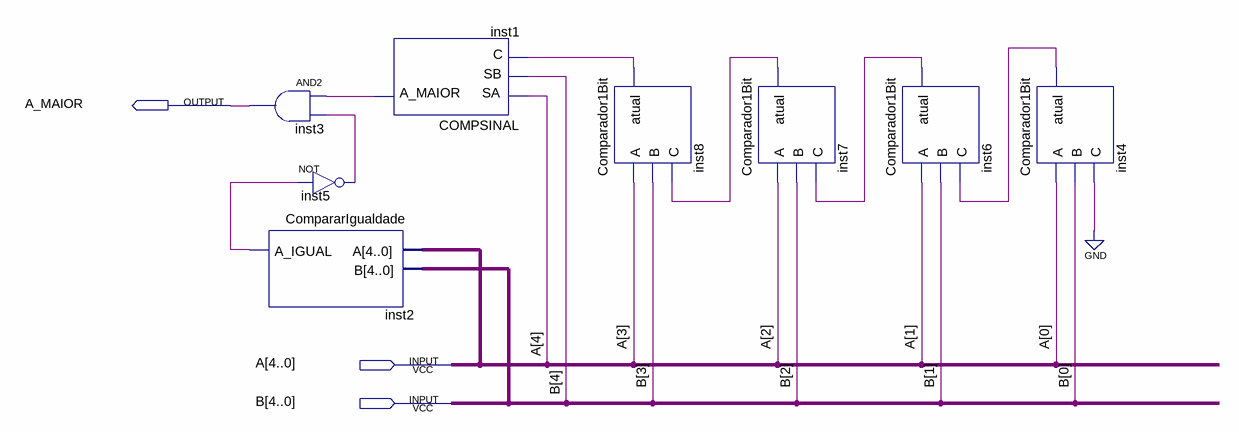
[diagram p0: schematic sheet]
// Quartus schematic ComparadorMaior.bdf as structural Verilog: 8 symbols, 3 pins
module ComparadorMaior (
  input  [4:0] A,
  input  [4:0] B,
  output A_MAIOR
);

  wire inst1_a_maior, inst2_a_igual, inst4_atual, inst5_out, inst6_atual, inst7_atual, inst8_atual;

  and inst3 (A_MAIOR, inst1_a_maior, inst5_out);
  not inst5 (inst5_out, inst2_a_igual);
  CompararIgualdade inst2 (.A(A), .B(B), .A_IGUAL(inst2_a_igual));
  COMPSINAL inst1 (.SA(A[4]), .SB(B[4]), .C(inst8_atual), .A_MAIOR(inst1_a_maior));
  Comparador1Bit inst8 (.A(A[3]), .B(B[3]), .C(inst7_atual), .atual(inst8_atual));
  Comparador1Bit inst7 (.A(A[2]), .B(B[2]), .C(inst6_atual), .atual(inst7_atual));
  Comparador1Bit inst6 (.A(A[1]), .B(B[1]), .C(inst4_atual), .atual(inst6_atual));
  Comparador1Bit inst4 (.A(A[0]), .B(B[0]), .C(1'b0), .atual(inst4_atual));
endmodule
